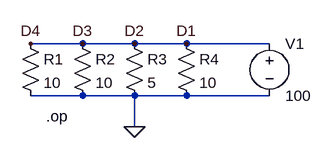
[diagram p0: schematic Draft7.asc]
Draft7.asc, the LTspice schematic file:
Version 4
SHEET 1 880 680
WIRE 80 144 0 144
WIRE 160 144 80 144
WIRE 240 144 160 144
WIRE 368 144 240 144
WIRE 80 224 0 224
WIRE 160 224 80 224
WIRE 240 224 160 224
WIRE 368 224 240 224
WIRE 160 272 160 224
FLAG 80 144 D3
FLAG 160 144 D2
FLAG 240 144 D1
FLAG 160 272 0
FLAG 0 144 D4
SYMBOL res -16 128 R0
SYMATTR InstName R1
SYMATTR Value 10
SYMBOL res 64 128 R0
SYMATTR InstName R2
SYMATTR Value 10
SYMBOL res 144 128 R0
SYMATTR InstName R3
SYMATTR Value 5
SYMBOL res 224 128 R0
SYMATTR InstName R4
SYMATTR Value 10
SYMBOL voltage 368 128 R0
SYMATTR InstName V1
SYMATTR Value 100
TEXT 24 256 Left 2 !.op

The netlist it stands for:
* Draft7.asc
R1 D4 0 10
R2 D4 0 10
R3 D4 0 5
R4 D4 0 10
V1 D4 0 100
.op
.backanno
.end